# Altium schematic sheet Main.SchDoc
size A4; SheetNumber: 1; SheetTotal: 4
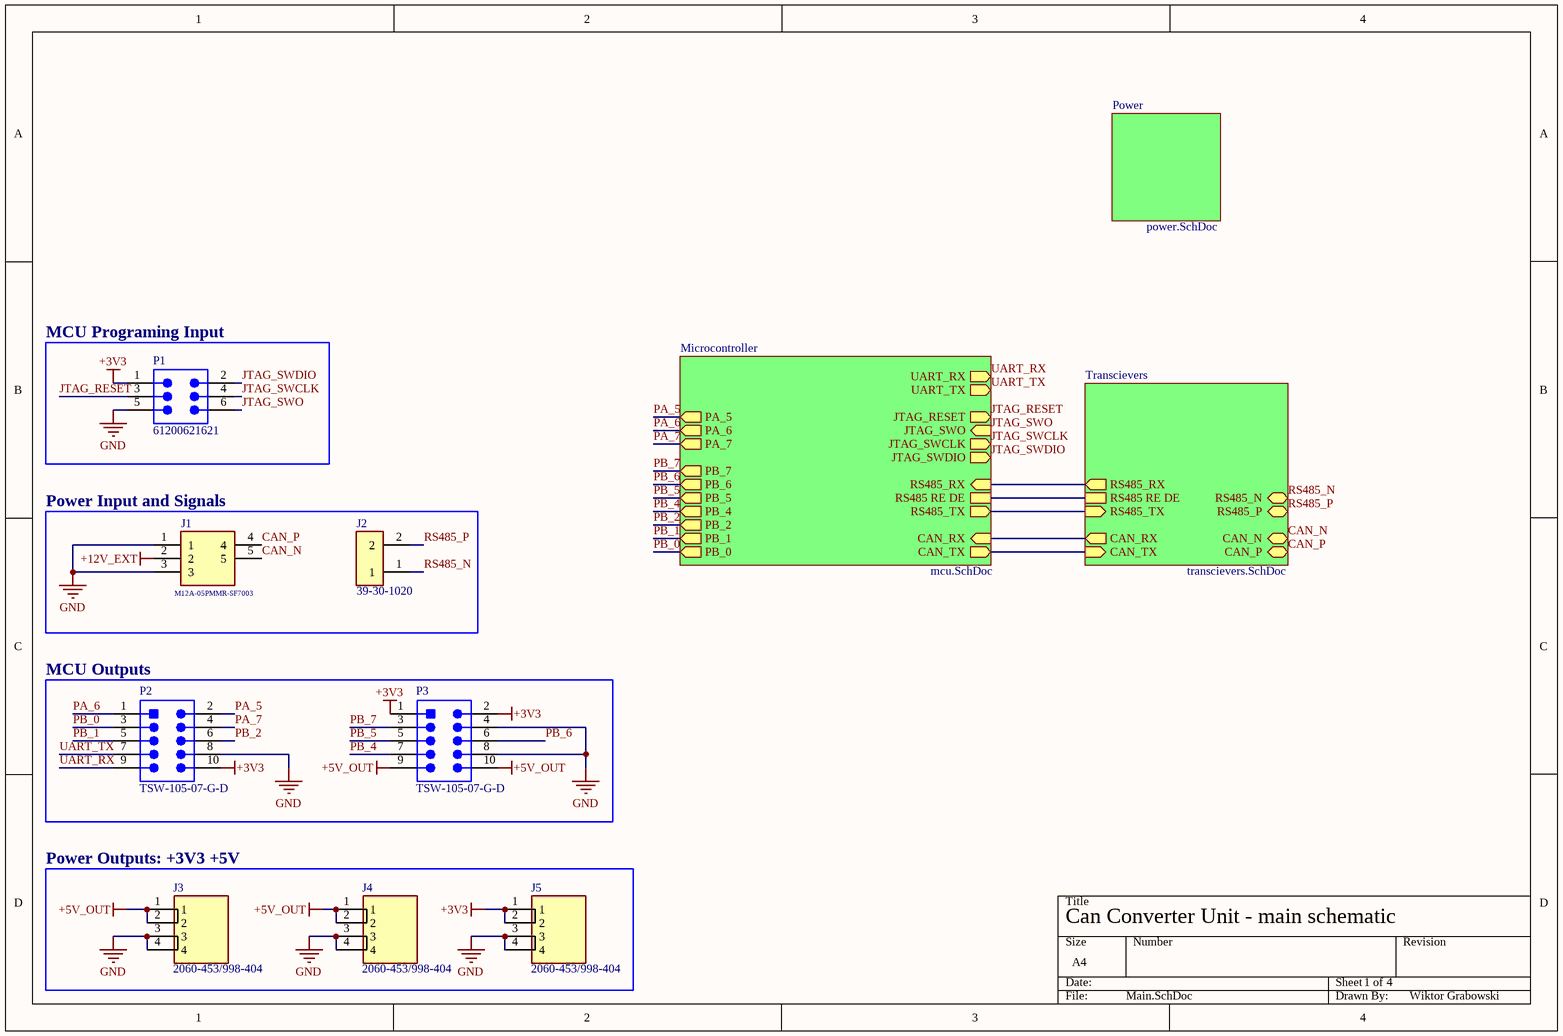
[diagram p0: Main.SchDoc]

## Parts
J1  M12A-05PMMR-SF7003  [M12A05PMMRSF7003]
J2  39-30-1020  [39-30-1020]
J3  2060-453/998-404  [WAGO-2060-452-998-404]
J4  2060-453/998-404  [WAGO-2060-452-998-404]
J5  2060-453/998-404  [WAGO-2060-452-998-404]
P1  61200621621  [61200621621]
P2  TSW-105-07-G-D  [SMTC-TSW-105-07-G-D_V]
P3  TSW-105-07-G-D  [SMTC-TSW-105-07-G-D_V]

## Blocks framed on the sheet
MCU Programing Input: P1
Power Input and Signals: J1 J2
MCU Outputs: P2 P3
Power Outputs: +3V3 +5V: J3-J5

## Sub-sheets
Microcontroller = mcu.SchDoc: UART_TX (out), UART_RX (out), RS485_TX (out), RS485_RX (in), PA_5 (out), PB_1 (out), PB_2 (out), PB_7 (out), PB_6 (out), PB_5 (out), PB_4 (out), PB_0 (out), RS485 RE DE, JTAG_SWO (in), JTAG_SWCLK (out), JTAG_SWDIO (out), PA_7 (out), PA_6 (out), CAN_RX (in), CAN_TX (out), JTAG_RESET (out)
Power = power.SchDoc: no entries
Transcievers = transcievers.SchDoc: RS485_RX (out), RS485_TX (in), RS485 RE DE, CAN_P (bidir), CAN_N (bidir), RS485_N (bidir), RS485_P (bidir), CAN_RX (out), CAN_TX (in)

## Nets
+3V3: J5.1 J5.2 P1.1 P2.10 P3.1 P3.2
+5V_OUT: J3.1 J3.2 J4.1 J4.2 P3.9 P3.10
+12V_EXT: J1.2
GND: J1.1 J1.3 J3.3 J3.4 J4.3 J4.4 J5.3 J5.4 P1.5 P2.8 P3.4 P3.8
CAN_N: J1.5 ; sheet Transcievers/CAN_N
CAN_P: J1.4 ; sheet Transcievers/CAN_P
JTAG_RESET: P1.3 ; sheet Microcontroller/JTAG_RESET
JTAG_SWCLK: P1.4 ; sheet Microcontroller/JTAG_SWCLK
JTAG_SWDIO: P1.2 ; sheet Microcontroller/JTAG_SWDIO
JTAG_SWO: P1.6 ; sheet Microcontroller/JTAG_SWO
PA_5: P2.2 ; sheet Microcontroller/PA_5
PA_6: P2.1 ; sheet Microcontroller/PA_6
PA_7: P2.4 ; sheet Microcontroller/PA_7
PB_0: P2.3 ; sheet Microcontroller/PB_0
PB_1: P2.5 ; sheet Microcontroller/PB_1
PB_2: P2.6 ; sheet Microcontroller/PB_2
PB_4: P3.7 ; sheet Microcontroller/PB_4
PB_5: P3.5 ; sheet Microcontroller/PB_5
PB_6: P3.6 ; sheet Microcontroller/PB_6
PB_7: P3.3 ; sheet Microcontroller/PB_7
RS485_N: J2.1 ; sheet Transcievers/RS485_N
RS485_P: J2.2 ; sheet Transcievers/RS485_P
UART_RX: P2.9 ; sheet Microcontroller/UART_RX
UART_TX: P2.7 ; sheet Microcontroller/UART_TX
(unnamed): sheet Microcontroller/RS485_TX, sheet Transcievers/RS485_TX
(unnamed): sheet Microcontroller/RS485_RX, sheet Transcievers/RS485_RX
(unnamed): sheet Microcontroller/RS485 RE DE, sheet Transcievers/RS485 RE DE
(unnamed): sheet Microcontroller/CAN_RX, sheet Transcievers/CAN_RX
(unnamed): sheet Microcontroller/CAN_TX, sheet Transcievers/CAN_TX

## Notes on the sheet
- Can Converter Unit - main schematic
- 1
- 4
- Wiktor Grabowski

## Library data of the parts
J1 = M12A-05PMMR-SF7003: M12, A Code, 4A, 05 pins, Male Contact, Hexagonal, M12*1.0, PCB 90ø, Front Fastened, IP67; Manufacturer_Name: Amphenol; Manufacturer: Amphenol LTW; Geometry.Height: 15mm; Connector Type: Signal; Number of Positions: 5; Voltage Rating: 60V; Manufacturer_Part_Number: M12A-05PMMR-SF7003; Mouser Part Number: 523-M12A05PMMRSF7003; Mouser Price/Stock: https://www.mouser.co.uk/ProductDetail/Amphenol-LTW/M12A-05PMMR-SF7003?qs=f9yNj16SXrIdWSE1H9dLLQ%3D%3D; Arrow Part Number: M12A-05PMMR-SF7003; Arrow Price/Stock: https://www.arrow.com/en/products/m12a-05pmmr-sf7003/amphenol?utm_currency=USD&region=nac; Datasheet Link: https://amphenolltw.com/down.php?prod_files=605433; Supplier: Avnet; Supplier Part Number: 50AC2957; Manufacturer Part Number: M12A-05PMMR-SF7003; RoHS: Compliant; Category: Circular Connectors; Stock: 32; Current Rating: 4A; Gender: Male; Lifecycle Status: Production; Pins: 5; ComponentLink1URL: https://datasheet.octopart.com:443/M12A-05PMMR-SF7003-Amphenol-datasheet-182346588.pdf?src-supplier=IHS; ComponentLink1Description: https://datasheet.octopart.com:443/M12A-05PMMR-SF7003-Amphenol-datasheet-182346588.pdf?src-supplier=IHS; ComponentLink2URL: https://datasheet.octopart.com:443/M12A-05PMMR-SF7003-Amphenol-LTW-datasheet-184719079.pdf?src-supplier=TME; ComponentLink2Description: https://datasheet.octopart.com:443/M12A-05PMMR-SF7003-Amphenol-LTW-datasheet-184719079.pdf?src-supplier=TME; ComponentLink3URL: https://datasheet.octopart.com:443/M12A-05PMMR-SF7003-Amphenol-LTW-datasheet-180194516.pdf?src-supplier=JRH+Electronics; ComponentLink3Description: https://datasheet.octopart.com:443/M12A-05PMMR-SF7003-Amphenol-LTW-datasheet-180194516.pdf?src-supplier=JRH+Electronics
J2 = 39-30-1020: Pin Header, Power, 2 Rows, 2 Contacts, Through Hole Right Angle, Mini-Fit Jr. 5569; Manufacturer: Molex; Manufacturer Lifecycle Status: ACTIVE; Approvals: CSA, TUV, UL; Connector Type: Power, Rectangular; Contact Resistance: 10mΩ; Current Rating: 9A; Dielectric Material: Polyamide; Gender: Male; Glow Wire Compliant: Non-compliant; Insulation Resistance: 1GΩ; Number of Circuits: 2; Pitch: 4.2mm; Plating Thickness: 2.54µm; Voltage Rating: 600V; Supplier: RS; Supplier Part Number: 5109837P; Manufacturer Part Number: 39-30-1020; RoHS: Compliant; Category: Headers and Wire Housings; Stock: 13118; China RoHS: Compliant; Color: Natural; Contact Gender: Male; Contact Material: Brass; Contact Plating: Tin; Country of Origin: US; Depth: 13.38mm; ELV: Compliant; Flammability Rating: UL94 V-2; Halogen Free: Low Halogen; Height: 14.76mm; Housing Material: Nylon; Lead Free: Lead Free; Lead Pitch: 4.2mm; Length: 36.07mm; Lifecycle Status: Production; Material: Nylon; Max Operating Temperature: 105°C; Min Operating Temperature: -40°C; Mounting Technology: PCB, Through Hole; Number of Contacts: 2; Pins: 2; Number of Poles: 2; Number of Positions: 2; Number of Rows: 2; Orientation: Right Angle; Radiation Hardening: No; REACH SVHC: Yes; Row Spacing: 4.2mm; Schedule B: 8536694040, 8536694040|8536694040, 8536694040|8536694040|8536694040, 8536694040|8536694040|8536694040|8536694040; Termination: Solder; Voltage Rating (AC): 600V; Voltage Rating (DC): 600V; Working Voltage: 600V; ComponentLink1URL: https://datasheet.octopart.com:443/39-30-1020-Molex-datasheet-120074128.pdf?src-supplier=IHS; ComponentLink1Description: https://datasheet.octopart.com:443/39-30-1020-Molex-datasheet-120074128.pdf?src-supplier=IHS; ComponentLink2URL: https://datasheet.octopart.com:443/039301020-Molex-datasheet-8338717.pdf?src-supplier=Upverter; ComponentLink2Description: https://datasheet.octopart.com:443/039301020-Molex-datasheet-8338717.pdf?src-supplier=Upverter; ComponentLink3URL: https://datasheet.octopart.com:443/39-30-1020-Molex-datasheet-13785309.pdf?src-supplier=Molex; ComponentLink3Description: https://datasheet.octopart.com:443/39-30-1020-Molex-datasheet-13785309.pdf?src-supplier=Molex; ComponentLink4URL: https://sigma.octopart.com:443/15644801/technical_drawing/Molex-39-30-1020.pdf?src-supplier=Molex; ComponentLink4Description: https://sigma.octopart.com:443/15644801/technical_drawing/Molex-39-30-1020.pdf?src-supplier=Molex; ComponentLink5URL: https://datasheet.octopart.com:443/39-30-1020-Molex-datasheet-36854730.pdf?src-supplier=Farnell; ComponentLink5Description: https://datasheet.octopart.com:443/39-30-1020-Molex-datasheet-36854730.pdf?src-supplier=Farnell; ComponentLink6URL: https://datasheet.octopart.com:443/39-30-1020-Molex-datasheet-101582405.pdf?src-supplier=Farnell; ComponentLink6Description: https://datasheet.octopart.com:443/39-30-1020-Molex-datasheet-101582405.pdf?src-supplier=Farnell; ComponentLink7URL: https://datasheet.octopart.com:443/39-30-1020-..-Molex-datasheet-81470918.pdf?src-supplier=Farnell; ComponentLink7Description: https://datasheet.octopart.com:443/39-30-1020-..-Molex-datasheet-81470918.pdf?src-supplier=Farnell; ComponentLink8URL: https://datasheet.octopart.com:443/39-30-1020-Molex-datasheet-14711183.pdf?src-supplier=Farnell; ComponentLink8Description: https://datasheet.octopart.com:443/39-30-1020-Molex-datasheet-14711183.pdf?src-supplier=Farnell; ComponentLink9URL: https://datasheet.octopart.com:443/39-30-1020-Molex-datasheet-10541087.pdf?src-supplier=Farnell; ComponentLink9Description: https://datasheet.octopart.com:443/39-30-1020-Molex-datasheet-10541087.pdf?src-supplier=Farnell; ComponentLink10URL: https://datasheet.octopart.com:443/39301020-Molex-datasheet-514359.pdf?src-supplier=Farnell; ComponentLink10Description: https://datasheet.octopart.com:443/39301020-Molex-datasheet-514359.pdf?src-supplier=Farnell; ComponentLink11URL: https://datasheet.octopart.com:443/39-30-1020-Molex-datasheet-154749331.pdf?src-supplier=Master+Electronics; ComponentLink11Description: https://datasheet.octopart.com:443/39-30-1020-Molex-datasheet-154749331.pdf?src-supplier=Master+Electronics; ComponentLink12URL: https://datasheet.octopart.com:443/39-30-1020-Molex-datasheet-21827347.pdf?src-supplier=Electro+Sonic; ComponentLink12Description: https://datasheet.octopart.com:443/39-30-1020-Molex-datasheet-21827347.pdf?src-supplier=Electro+Sonic; ComponentLink13URL: https://datasheet.octopart.com:443/39-30-1020-Molex-datasheet-62104194.pdf?src-supplier=Electro+Sonic; ComponentLink13Description: https://datasheet.octopart.com:443/39-30-1020-Molex-datasheet-62104194.pdf?src-supplier=Electro+Sonic; ComponentLink14URL: https://datasheet.octopart.com:443/39-30-1020-Molex-datasheet-140183168.pdf?src-supplier=RS+(Formerly+Allied+Electronics); ComponentLink14Description: https://datasheet.octopart.com:443/39-30-1020-Molex-datasheet-140183168.pdf?src-supplier=RS+(Formerly+Allied+Electronics); ComponentLink15URL: https://datasheet.octopart.com:443/39-30-1020-Molex-datasheet-120148721.pdf?src-supplier=RS+(Formerly+Allied+Electronics); ComponentLink15Description: https://datasheet.octopart.com:443/39-30-1020-Molex-datasheet-120148721.pdf?src-supplier=RS+(Formerly+Allied+Electronics); ComponentLink16URL: https://datasheet.octopart.com:443/39-30-1020-Molex-datasheet-34442213.pdf?src-supplier=RS+(Formerly+Allied+Electronics); ComponentLink16Description: https://datasheet.octopart.com:443/39-30-1020-Molex-datasheet-34442213.pdf?src-supplier=RS+(Formerly+Allied+Electronics); ComponentLink17URL: https://datasheet.octopart.com:443/39-30-1020-Molex-datasheet-9997016.pdf?src-supplier=RS+(Formerly+Allied+Electronics); ComponentLink17Description: https://datasheet.octopart.com:443/39-30-1020-Molex-datasheet-9997016.pdf?src-supplier=RS+(Formerly+Allied+Electronics); ComponentLink18URL: https://datasheet.octopart.com:443/39-30-1020-Molex-datasheet-46140.pdf?src-supplier=RS+(Formerly+Allied+Electronics); ComponentLink18Description: https://datasheet.octopart.com:443/39-30-1020-Molex-datasheet-46140.pdf?src-supplier=RS+(Formerly+Allied+Electronics); ComponentLink19URL: https://datasheet.octopart.com:443/39301020-Molex-datasheet-82994803.pdf?src-supplier=Newark; ComponentLink19Description: https://datasheet.octopart.com:443/39301020-Molex-datasheet-82994803.pdf?src-supplier=Newark; ComponentLink20URL: https://datasheet.octopart.com:443/39-30-1020-Molex-datasheet-33002868.pdf?src-supplier=Newark; ComponentLink20Description: https://datasheet.octopart.com:443/39-30-1020-Molex-datasheet-33002868.pdf?src-supplier=Newark; ComponentLink21URL: https://datasheet.octopart.com:443/39-30-1020-Molex-datasheet-21207481.pdf?src-supplier=Newark; ComponentLink21Description: https://datasheet.octopart.com:443/39-30-1020-Molex-datasheet-21207481.pdf?src-supplier=Newark; ComponentLink22URL: https://datasheet.octopart.com:443/39-30-1020-Molex-datasheet-2405.pdf?src-supplier=Newark; ComponentLink22Description: https://datasheet.octopart.com:443/39-30-1020-Molex-datasheet-2405.pdf?src-supplier=Newark; ComponentLink23URL: https://datasheet.octopart.com:443/39301020-Molex-datasheet-137316104.pdf?src-supplier=Future+Electronics; ComponentLink23Description: https://datasheet.octopart.com:443/39301020-Molex-datasheet-137316104.pdf?src-supplier=Future+Electronics; ComponentLink24URL: https://datasheet.octopart.com:443/39-30-1020-Molex-datasheet-21395541.pdf?src-supplier=TME; ComponentLink24Description: https://datasheet.octopart.com:443/39-30-1020-Molex-datasheet-21395541.pdf?src-supplier=TME; ComponentLink25URL: https://datasheet.octopart.com:443/39301020-Molex-datasheet-7600579.pdf?src-supplier=Jameco; ComponentLink25Description: https://datasheet.octopart.com:443/39301020-Molex-datasheet-7600579.pdf?src-supplier=Jameco; ComponentLink26URL: https://datasheet.octopart.com:443/39-30-1020-Molex-datasheet-46912895.pdf?src-supplier=Jameco; ComponentLink26Description: https://datasheet.octopart.com:443/39-30-1020-Molex-datasheet-46912895.pdf?src-supplier=Jameco; ComponentLink27URL: https://datasheet.octopart.com:443/39-30-1020-Molex-datasheet-131607.pdf?src-supplier=DigiKey; ComponentLink27Description: https://datasheet.octopart.com:443/39-30-1020-Molex-datasheet-131607.pdf?src-supplier=DigiKey; ComponentLink28URL: http://sigma.octopart.com:80/15645372/rohs_certificate/Molex-39-30-1020.pdf?src-supplier=Compliance+Statements; ComponentLink28Description: http://sigma.octopart.com:80/15645372/rohs_certificate/Molex-39-30-1020.pdf?src-supplier=Compliance+Statements; ComponentLink29URL: http://sigma.octopart.com:80/conflict_mineral_statement/Molex-company-72.pdf?src-supplier=Compliance+Statements; ComponentLink29Description: http://sigma.octopart.com:80/conflict_mineral_statement/Molex-company-72.pdf?src-supplier=Compliance+Statements; ComponentLink30URL: http://sigma.octopart.com:80/rohs_statement/Molex-company-73.pdf?src-supplier=Compliance+Statements; ComponentLink30Description: http://sigma.octopart.com:80/rohs_statement/Molex-company-73.pdf?src-supplier=Compliance+Statements; ComponentLink31URL: http://sigma.octopart.com:80/reach_statement/Molex-company-74.pdf?src-supplier=Compliance+Statements; ComponentLink31Description: http://sigma.octopart.com:80/reach_statement/Molex-company-74.pdf?src-supplier=Compliance+Statements
J3-J5 = WAGO-2060-452-998-404: SMD Pcb Terminal Block, Push-button 0.75 MM² Pin Spacing 4 Mm 3-POLE White; Manufacturer: WAGO; Approvals: CSA, EN, IEC, KEMA, cUL; Current Rating: 9A; Number of Contacts: 3; Number of Levels: 1; Pitch: 4mm; Stripping Length: -7mm; Voltage Rating: 320V; Wire/Cable Gauge: 18AWG; Supplier: Arrow Electronics; Supplier Part Number: 2060-453/998-404; Manufacturer Part Number: 2060-453/998-404; RoHS: Compliant; Category: Terminal Blocks; Stock: 3276; Pricing: 1=0,602, 10=0,569, 25=0,552, 100=0,533, 500=0,528, 1000=0,523 (USD); China RoHS: Compliant; Color: White; Contact Material: Tin; Contact Plating: Tin; Flammability Rating: UL94 V-0; Height: 4.5mm; Lead Free: Lead Free; Length: 11.9mm; Lifecycle Status: Production; Material: Copper, Tin; Number of Rows: 1; Orientation: Horizontal; REACH SVHC: Yes; Schedule B: 8536695050; Width: 10.1mm; ComponentLink1URL: https://datasheet.octopart.com:443/2060-453-998-404-WAGO-datasheet-38222450.pdf?src-supplier=SOS+electronic; ComponentLink1Description: https://datasheet.octopart.com:443/2060-453-998-404-WAGO-datasheet-38222450.pdf?src-supplier=SOS+electronic; ComponentLink2URL: https://datasheet.octopart.com:443/2060-453-998-404-WAGO-datasheet-49279272.pdf?src-supplier=Newark; ComponentLink2Description: https://datasheet.octopart.com:443/2060-453-998-404-WAGO-datasheet-49279272.pdf?src-supplier=Newark; ComponentLink3URL: https://datasheet.octopart.com:443/2060-453-998-404-WAGO-datasheet-182466479.pdf?src-supplier=Future+Electronics; ComponentLink3Description: https://datasheet.octopart.com:443/2060-453-998-404-WAGO-datasheet-182466479.pdf?src-supplier=Future+Electronics; ComponentLink4URL: https://datasheet.octopart.com:443/2060-453-998-404-WAGO-datasheet-26529559.pdf?src-supplier=Future+Electronics; ComponentLink4Description: https://datasheet.octopart.com:443/2060-453-998-404-WAGO-datasheet-26529559.pdf?src-supplier=Future+Electronics; ComponentLink5URL: https://datasheet.octopart.com:443/2060-453-998-404-WAGO-datasheet-140898747.pdf?src-supplier=Future+Electronics; ComponentLink5Description: https://datasheet.octopart.com:443/2060-453-998-404-WAGO-datasheet-140898747.pdf?src-supplier=Future+Electronics; ComponentLink6URL: https://datasheet.octopart.com:443/2060-453-998-404-WAGO-datasheet-164886439.pdf?src-supplier=Burklin+Elektronik; ComponentLink6Description: https://datasheet.octopart.com:443/2060-453-998-404-WAGO-datasheet-164886439.pdf?src-supplier=Burklin+Elektronik
P1 = CMP-1502-00000-2: NexarPartId: 32855456; Number of Positions: 6; Gender: Male; Pitch: 2.54mm; Connector Type: Male Pin; Insulation Resistance: 1GΩ; Contact Resistance: 20mΩ; Operating Supply Voltage: 250V; Current Rating: 3A; Termination: Solder; RoHS: Compliant; Length: 15.28mm; Contact Material: Copper; Number of Pins: 6; Min Operating Temperature: -40°C; Number of Contacts: 6; Number of Rows: 2; Contact Plating: Gold; Color: Black; Mount: Through Hole; Lead Pitch: 2.54mm; Insulation Material: PBT; REACH SVHC: Unknown; Row Spacing: 2.54mm; Orientation: Vertical; Max Operating Temperature: 105°C
P2 P3 = CMP-2000-07330-1: Post Terminal Strip Assembly, Pitch 2.54 mm, 2 x 5 Position, Height 8.58 mm, Tail Length 2.54 mm, -55 to 125 degC, RoHS, Bulk; Manufacturer: Samtec-Inc.; Connector Type: Header,Unshrouded; Number of Positions Loaded: All; Pitch: 0.100"(2.54mm); Number of Positions: 10; Package Reference: TSW-105-07-G-D; Mounting Technology: ThroughHole; Datasheet URL: http://suddendocs.samtec.com/prints/tsw-xxx-xx-xxx-x-xx-xxx-mkt.pdf; Termination: Solder; Packaging: Bulk; Number of Rows: 2; Contact Finish: Gold; Mounting Type: ThroughHole; Features: -; Color: Black; Category: Connectors,Interconnects; Family: RectangularConnectors-Headers,MalePins; Manufacturer URL: http://www.samtec.com/; Series: TSW; Fastening Type: -; Package URL: http://suddendocs.samtec.com/prints/tsw-xxx-xx-x-x-xx-xxx-footprint.pdf; Row Spacing: 0.100"(2.54mm); Contact Mating Length: 0.230"(5.84mm); Contact Finish Thickness: 10µin(0.25µm); Contact Type: MalePin; Package Description: Male Header, Pitch 2.54 mm, 2 x 5 Position, Height 8.58 mm, Tail Length 2.54 mm; Datasheet Version: Rev. DO, 08/1988